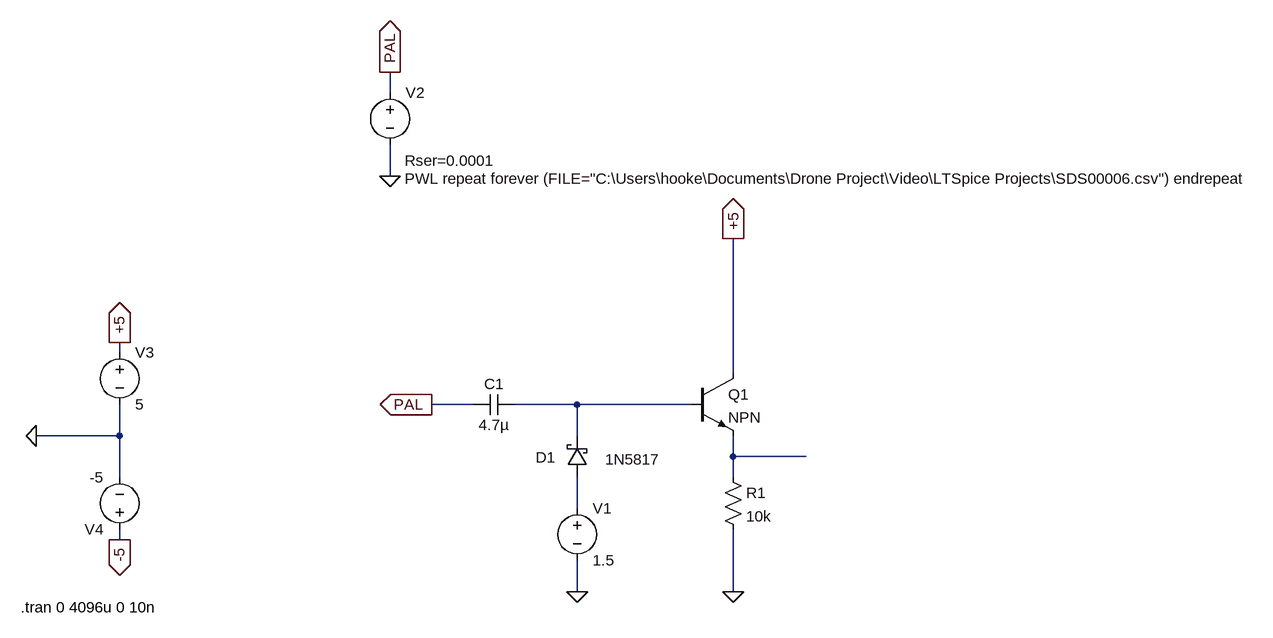
[diagram p0: schematic Sync_Seperator.asc]
Sync_Seperator.asc, the LTspice schematic file:
Version 4
SHEET 1 1312 680
WIRE -144 -336 -144 -368
WIRE -144 -208 -144 -256
WIRE -560 64 -560 48
WIRE 384 96 384 -112
WIRE -16 144 -80 144
WIRE 144 144 48 144
WIRE 320 144 144 144
WIRE -560 192 -560 144
WIRE -560 192 -688 192
WIRE 144 192 144 144
WIRE 384 224 384 192
WIRE 496 224 384 224
WIRE -560 256 -560 192
WIRE 384 256 384 224
WIRE 144 304 144 256
WIRE -560 352 -560 336
WIRE 144 432 144 384
WIRE 384 432 384 336
FLAG -80 144 PAL
IOPIN -80 144 Out
FLAG 144 432 0
FLAG 384 -112 +5
IOPIN 384 -112 Out
FLAG 384 432 0
FLAG -144 -368 PAL
IOPIN -144 -368 Out
FLAG -144 -208 0
FLAG -560 48 +5
IOPIN -560 48 Out
FLAG -560 352 -5
IOPIN -560 352 Out
FLAG -688 192 0
SYMBOL cap 48 128 R90
WINDOW 0 0 32 VBottom 2
WINDOW 3 32 32 VTop 2
SYMATTR InstName C1
SYMATTR Value 4.7µ
SYMBOL voltage 144 288 R0
WINDOW 123 0 0 Left 0
WINDOW 39 0 0 Left 0
SYMATTR InstName V1
SYMATTR Value 1.5
SYMBOL schottky 160 256 R180
WINDOW 0 49 31 Left 2
WINDOW 3 -112 28 Left 2
SYMATTR InstName D1
SYMATTR Value 1N5817
SYMATTR Description Diode
SYMATTR Type diode
SYMBOL voltage -144 -352 R0
WINDOW 39 23 120 Left 2
WINDOW 3 23 148 Left 2
SYMATTR SpiceLine Rser=0.0001
SYMATTR Value PWL repeat forever (FILE="C:\Users\hooke\Documents\Drone Project\Video\LTSpice Projects\SDS00006.csv") endrepeat
SYMATTR InstName V2
SYMBOL voltage -560 48 R0
WINDOW 123 0 0 Left 0
WINDOW 39 0 0 Left 0
SYMATTR InstName V3
SYMATTR Value 5
SYMBOL voltage -560 352 R180
WINDOW 123 0 0 Left 0
WINDOW 39 0 0 Left 0
SYMATTR InstName V4
SYMATTR Value -5
SYMBOL res 368 240 R0
SYMATTR InstName R1
SYMATTR Value 10k
SYMBOL npn 320 96 R0
SYMATTR InstName Q1
TEXT -712 456 Left 2 !.tran 0 4096u 0 10n

The netlist it stands for:
* Sync_Seperator.asc
C1 N001 PAL 4.7µ
V1 N003 0 1.5
D1 N003 N001 1N5817
V2 PAL 0 PWL repeat forever (FILE="C:\Users\hooke\Documents\Drone Project\Video\LTSpice Projects\SDS00006.csv") endrepeat Rser=0.0001
V3 +5 0 5
V4 -5 0 -5
R1 N002 0 10k
Q1 +5 N001 N002 0 NPN
.model D D
.lib standard.dio
.model NPN NPN
.model PNP PNP
.lib standard.bjt
.tran 0 4096u 0 10n
.backanno
.end